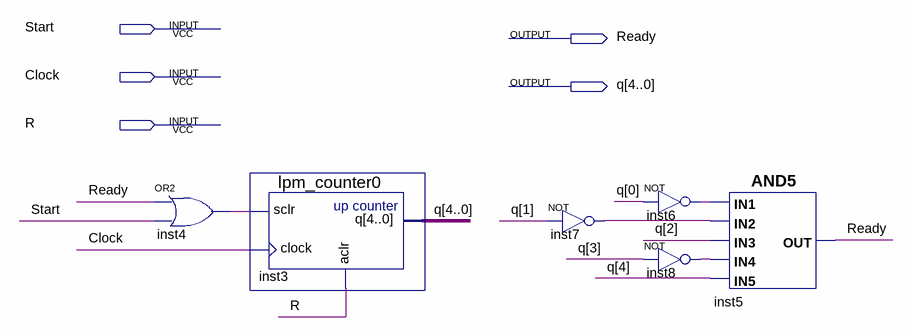
[diagram p0: schematic sheet]
// Quartus schematic count_cycle.bdf as structural Verilog: 6 symbols, 5 pins
module count_cycle (
  input  Start,
  input  Clock,
  input  R,
  output Ready,
  output [4:0] q
);

  wire inst4_out, inst6_out, inst7_out, inst8_out;

  or inst4 (inst4_out, Ready, Start);
  lpm_counter0 inst3 (.sclr(inst4_out), .clock(Clock), .aclr(R), .q(q));
  not inst7 (inst7_out, q[1]);
  and inst5 (Ready, inst6_out, inst7_out, q[2], inst8_out, q[4]);
  not inst6 (inst6_out, q[0]);
  not inst8 (inst8_out, q[3]);
endmodule
